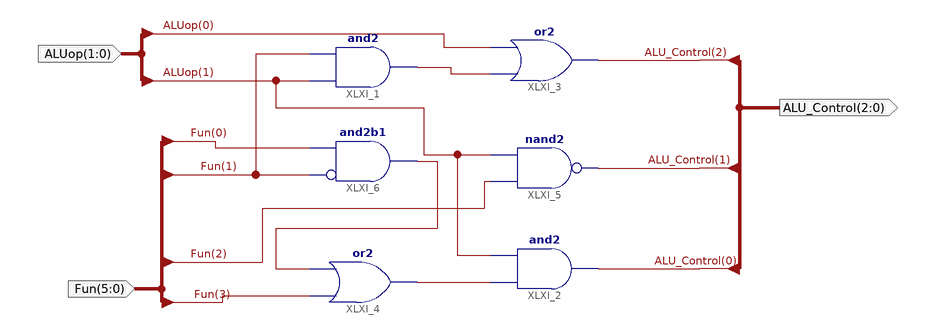
[diagram p0: schematic sheet 1]
// Xilinx ISE schematic ALU_Decoder.sch (kintex7) as structural Verilog: 6 symbols, 3 ports
module ALU_Decoder (
  input  [1:0] ALUop,
  input  [5:0] Fun,
  output [2:0] ALU_Control
);

  wire XLXN_1, XLXN_5, XLXN_6;

  and XLXI_1 (XLXN_1, ALUop[1], Fun[1]);
  and XLXI_2 (ALU_Control[0], XLXN_6, ALUop[1]);
  or XLXI_3 (ALU_Control[2], XLXN_1, ALUop[0]);
  or XLXI_4 (XLXN_6, Fun[3], XLXN_5);
  nand XLXI_5 (ALU_Control[1], Fun[2], ALUop[1]);
  and XLXI_6 (XLXN_5, ~Fun[1], Fun[0]);  // and2b1
endmodule
